# EAGLE design field_rotator (EAGLE 7.3.0)
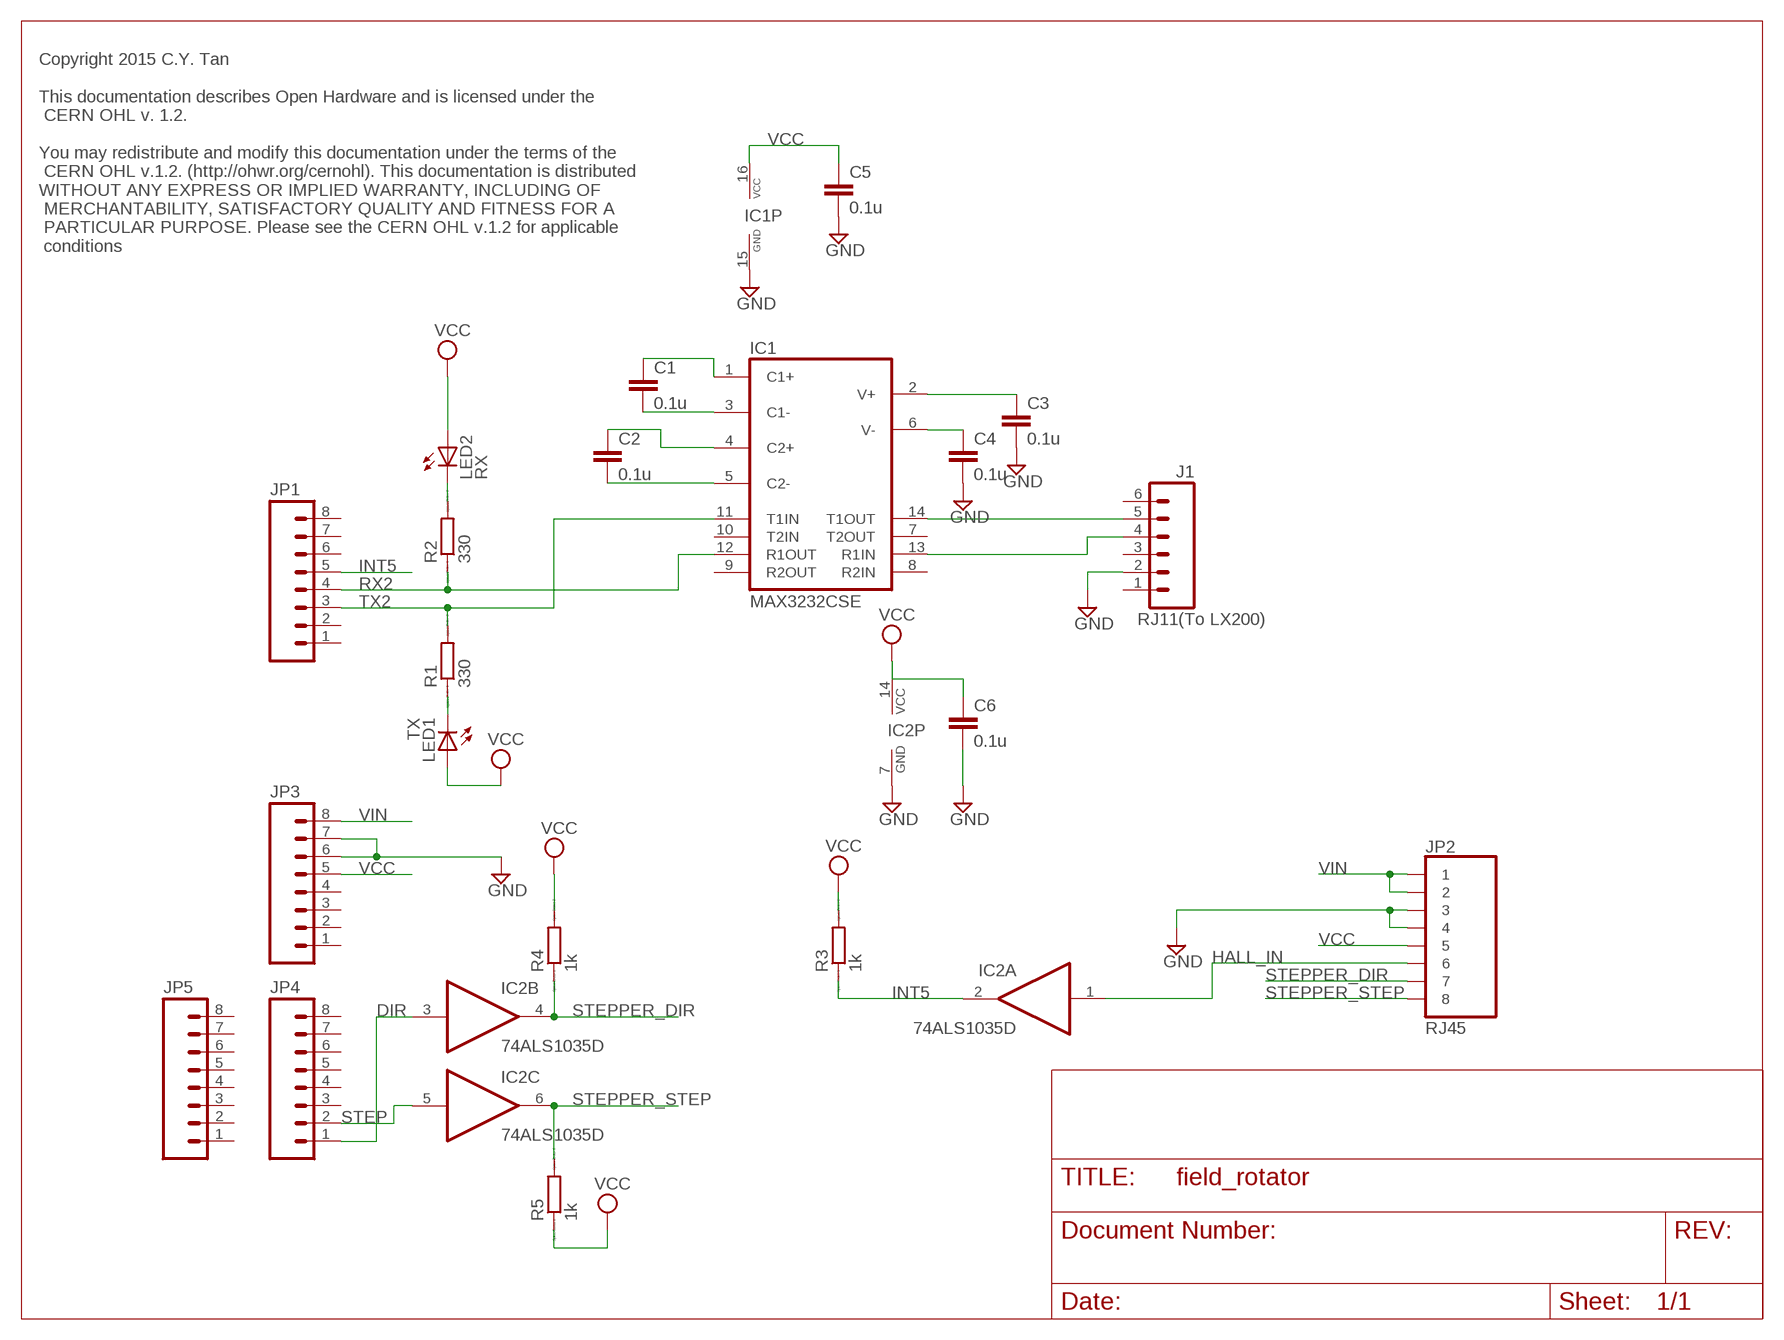
[diagram p0: schematic, sheet 1]

## Parts
C1  0.1u  C-EUC1206  [C1206]
C2  0.1u  C-EUC1206  [C1206]
C3  0.1u  C-EUC1206  [C1206]
C4  0.1u  C-EUC1206  [C1206]
C5  0.1u  C-EUC1206  [C1206]
C6  0.1u  C-EUC1206  [C1206]
IC1  MAX3232CSE  [SO16]
IC2  74ALS1035D  [SO14]
J1  RJ11(To LX200)  RJ11-6PTH  [RJ11-6]
JP1  M08SILK_FEMALE_PTH  [1X08]
JP2  RJ45  RJ45-8PTH  [RJ45-8]
JP3  M08SILK_FEMALE_PTH  [1X08]
JP4  M08SILK_FEMALE_PTH  [1X08]
JP5  M08SILK_FEMALE_PTH  [1X08]
LED1  TX  LEDCHIPLED_1206  [CHIPLED_1206]
LED2  RX  LEDCHIPLED_1206  [CHIPLED_1206]
R1  330  R  [R0805]
R2  330  R  [R0805]
R3  1k  R  [R0805]
R4  1k  R  [R0805]
R5  1k  R  [R0805]

## Nets
DIR: IC2.3(B:I) JP4.1
GND: C3.2 C4.2 C5.2 C6.2 IC1.15(GND) IC2.7(P:GND) J1.2 JP2.3 JP2.4 JP3.6 JP3.7
HALL_IN: IC2.1(A:I) JP2.6
INT5: IC2.2(A:O) JP1.5 R3.1
N$1: C1.1 IC1.1(C1+)
N$2: C1.2 IC1.3(C1-)
N$3: C2.1 IC1.4(C2+)
N$4: C2.2 IC1.5(C2-)
N$5: C3.1 IC1.2(V+)
N$6: C4.1 IC1.6(V-)
N$7: LED1.C R1.1
N$8: LED2.C R2.2
N$9: IC1.14(T1OUT) J1.5
N$10: IC1.13(R1IN) J1.4
RX2: IC1.12(R1OUT) JP1.4 R2.1
STEP: IC2.5(C:I) JP4.2
STEPPER_DIR: IC2.4(B:O) JP2.7 R4.1
STEPPER_STEP: IC2.6(C:O) JP2.8 R5.2
TX2: IC1.11(T1IN) JP1.3 R1.2
VCC: C5.1 C6.1 IC1.16(VCC) IC2.14(P:VCC) JP2.5 JP3.5 LED1.A LED2.A R3.2 R4.2 R5.1
VIN: JP2.1 JP2.2 JP3.8
Unconnected: IC1.7(T2OUT) IC1.8(R2IN) IC1.9(R2OUT) IC1.10(T2IN) IC2.8(D:O) IC2.9(D:I) IC2.10(E:O) IC2.11(E:I) IC2.12(F:O) IC2.13(F:I) J1.1 J1.3 J1.6 JP1.1 JP1.2 JP1.6 JP1.7 JP1.8 JP3.1 JP3.2 JP3.3 JP3.4 JP4.3 JP4.4 JP4.5 JP4.6 JP4.7 JP4.8 JP5.1 JP5.2 JP5.3 JP5.4 JP5.5 JP5.6 JP5.7 JP5.8

## Notes on the sheet
- Copyright 2015 C.Y. Tan
  
  This documentation describes Open Hardware and is licensed under the
   CERN OHL v. 1.2. 
  
  You may redistribute and modify this documentation under the terms of the
   CERN OHL v.1.2. (http://ohwr.org/cernohl). This documentation is distributed 
  WITHOUT ANY EXPRESS OR IMPLIED WARRANTY, INCLUDING OF
   MERCHANTABILITY, SATISFACTORY QUALITY AND FITNESS FOR A
   PARTICULAR PURPOSE. Please see the CERN OHL v.1.2 for applicable
   conditions

## Library data of the parts
C1-C6 = resistor:C-EU: CAPACITOR, European symbol
IC1 = maxim:MAX3232*: True RS-232 Transceivers 3.0V to 5.5V, Low-Power up to 1Mbps, Using Four 0.1µF External Capacitors Source: http://pdfserv.maxim-ic.com/en/ds/MAX3222-MAX3241.pdf; MPN: MAX3232CSE; OC_FARNELL: 9725490; OC_NEWARK: 90C2890
IC2 = cytan:74ALS1035: Hex noninverting buffers with open-collector outputs
J1 = cytan:RJ11-6: RJ11 Jack Simple 6 pin RJ11 jack. Commonly found on CAT3 devices and Microchip programmers. SKU: Jameco-115837; PROD_ID: Jameco-115837; VALUE: RJ11
JP1 JP3-JP5 = SparkFun-Connectors:M08: Header 8 Standard 8-pin 0.1" header. Use with straight break away headers (SKU : PRT-00116), right angle break away headers (PRT-00553), swiss pins (PRT-00743), machine pins (PRT-00117), and female headers (PRT-00115).; PROD_ID: CONN-08438
JP2 = cytan:RJ45-8: RJ45 Jack RJ45, 8-pin connection. SKU: Jameco 524461.; PROD_ID: Jameco-524461
LED1 LED2 = led:LED: LED OSRAM: - CHIPLED LG R971, LG N971, LY N971, LG Q971, LY Q971, LO R971, LY R971 LH N974, LH R974 LS Q976, LO Q976, LY Q976 LO Q996 - Hyper CHIPLED LW Q18S LB Q993, LB Q99A, LB R99A - SideLED LS A670, LO A670, LY A670, LG A670, LP A670 LB A673, LV A673, LT A673, LW A673 LH A674 LY A675 LS A676, LA A676, LO A676, LY A676, LW A676 LS A679, LY A679, LG A679 - Hyper Micro SIDELED® LS Y876, LA Y876, LO Y876, LY Y876 LT Y87S - SmartLED LW L88C, LW L88S LB L89C, LB L89S, LG L890 LS L89K, LO L89K, LY L89K LS L896, LA L896, LO L896, LY L896 - TOPLED LS T670, LO T670, LY T670, LG T670, LP T670 LSG T670, LSP T670, LSY T670, LOP T670, LYG T670 LG T671, LOG T671, LSG T671 LB T673, LV T673, LT T673, LW T673 LH T674 LS T676, LA T676, LO T676, LY T676, LB T676, LH T676, LSB T676, LW T676 LB T67C, LV T67C, LT T67C, LS T67K, LO T67K, LY T67K, LW E67C LS E67B, LA E67B, LO E67B, LY E67B, LB E67C, LV E67C, LT E67C LW T67C LS T679, LY T679, LG T679 LS T770, LO T770, LY T770, LG T770, LP T770 LB T773, LV T773, LT T773, LW T773 LH T774 LS E675, LA E675, LY E675, LS T675 LS T776, LA T776, LO T776, LY T776, LB T776 LHGB T686 LT T68C, LB T68C - Hyper Mini TOPLED® LB M676 - Mini TOPLED Santana® LG M470 LS M47K, LO M47K, LY M47K Source: http://www.osram.convergy.de LUXEON: - LUMILED® LXK2-PW12-R00, LXK2-PW12-S00, LXK2-PW14-U00, LXK2-PW14-V00 LXK2-PM12-R00, LXK2-PM12-S00, LXK2-PM14-U00 LXK2-PE12-Q00, LXK2-PE12-R00, LXK2-PE12-S00, LXK2-PE14-T00, LXK2-PE14-U00 LXK2-PB12-K00, LXK2-PB12-L00, LXK2-PB12-M00, LXK2-PB14-N00, LXK2-PB14-P00, LXK2-PB14-Q00 LXK2-PR12-L00, LXK2-PR12-M00, LXK2-PR14-Q00, LXK2-PR14-R00 LXK2-PD12-Q00, LXK2-PD12-R00, LXK2-PD12-S00 LXK2-PH12-R00, LXK2-PH12-S00 LXK2-PL12-P00, LXK2-PL12-Q00, LXK2-PL12-R00 Source: www.luxeon.com KINGBRIGHT: KA-3528ASYC Source: www.kingbright.com
R1-R5 = eagle-ltspice:R: RESISTOR, European symbol; SPICEMODEL: NONE; SPICEPREFIX: R

## Board
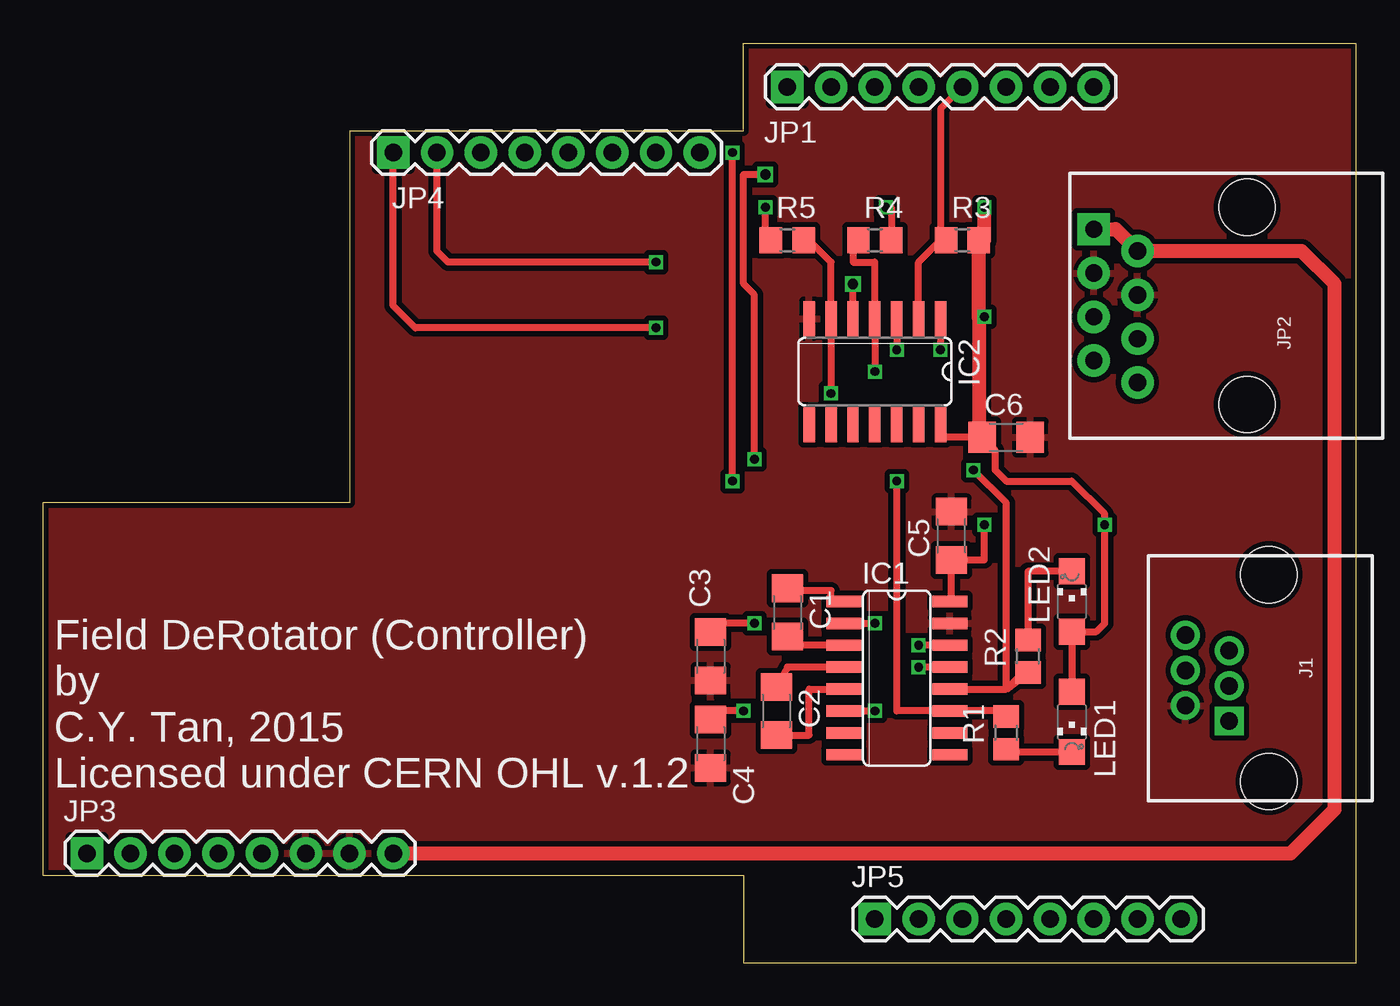
[diagram p1: board, top side]
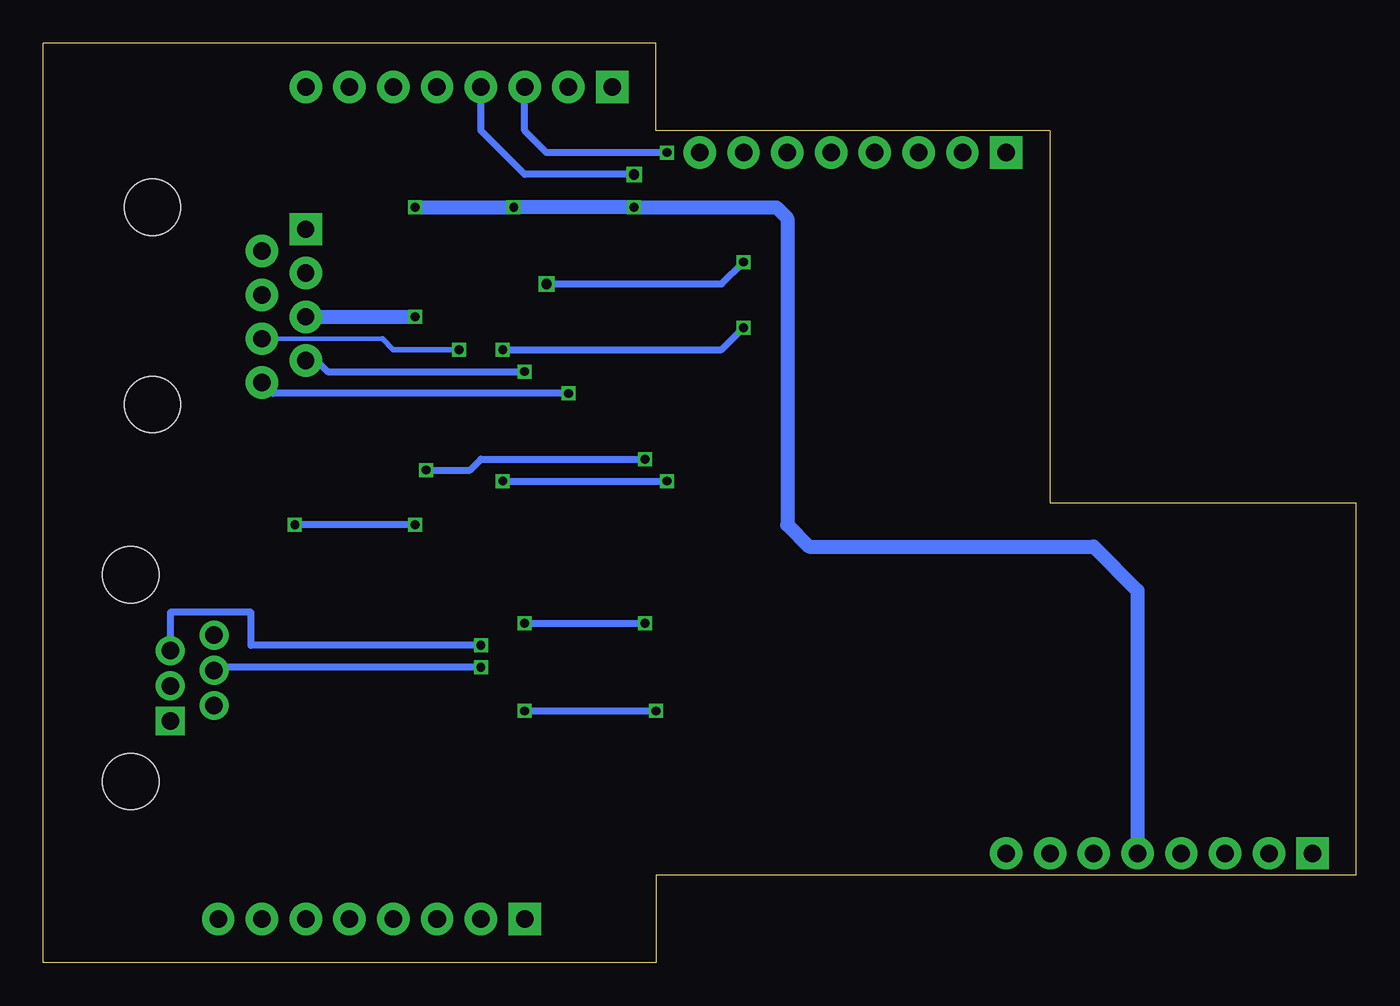
[diagram p2: board, bottom side, seen from below]

Size 76.2 x 53.34 mm. Coordinates in mm from the lower left corner, seen from the top.
Outline: 0,5.08 0,26.67 17.78,26.67 17.78,48.26 40.64,48.26 40.64,53.34 76.2,53.34 76.2,0 40.64,0 40.64,5.08 0,5.08
Copper layers (1*16): Top 0.035mm / dielectric 1.5mm / Bottom 0.035mm
Design rules "ITEADstudio_DRC": minimum track width 6mil, minimum drill 12mil, track to track 6mil, track to pad 6mil, pad to pad 6mil, via to via 6mil, smd to smd 0mil, copper to edge 10mil, drill to drill 10mil, minimum pad ring 10mil, minimum via ring 6mil, stop-mask expansion 2mil, vias tented up to drill 100mil, thermal gap 10mil

### Footprints (pad centres in the part's own frame; a part is rotated, then mirrored left to right if it is on the bottom)
C1206 = smd 1.6 x 1.8: 1 -1.4,0; 2 1.4,0
SO16 = smd 0.66 x 2.032: 1 -4.445,-3.073; 2 -3.175,-3.073; 3 -1.905,-3.073; 4 -0.635,-3.073; 5 0.635,-3.073; 6 1.905,-3.073; 7 3.175,-3.073; 8 4.445,-3.073; 9 4.445,3.073; 10 3.175,3.073; 11 1.905,3.073; 12 0.635,3.073; 13 -0.635,3.073; 14 -1.905,3.073; 15 -3.175,3.073; 16 -4.445,3.073
SO14 = smd 0.66 x 2.032: 1 -3.81,-3.073; 2 -2.54,-3.073; 3 -1.27,-3.073; 4 0,-3.073; 5 1.27,-3.073; 6 2.54,-3.073; 7 3.81,-3.073; 8 3.81,3.073; 9 2.54,3.073; 10 1.27,3.073; 11 0,3.073; 12 -1.27,3.073; 13 -2.54,3.073; 14 -3.81,3.073
RJ11-6 = drill 1.016 pad 1.676 square: 1 -2.489,2.299 | drill 1.016 pad 1.676: 2 -1.59,4.839; 3 -0.45,2.299; 4 0.45,4.839; 5 1.59,2.299; 6 2.489,4.839 | hole 3.251: -5.999,0; 5.999,0
1X08 = drill 1.016 pad 1.88 square: 1 0,0 | drill 1.016 pad 1.88: 2 2.54,0; 3 5.08,0; 4 7.62,0; 5 10.16,0; 6 12.7,0; 7 15.24,0; 8 17.78,0
RJ45-8 = drill 1 pad 1.88 square: 1 4.445,8.89 | drill 1 pad 1.88: 2 3.175,6.35; 3 1.905,8.89; 4 0.635,6.35; 5 -0.635,8.89; 6 -1.905,6.35; 7 -3.175,8.89; 8 -4.445,6.35 | hole 3.251: -5.715,0; 5.715,0
CHIPLED_1206 = smd 1.5 x 1.5: A 0,-1.75; C 0,1.75
R0805 = smd 1.3 x 1.5: 1 -0.95,0; 2 0.95,0

### Placement (x,y rotation side)
C1  43.18,20.32 270 top
C2  42.55,14.61 270 top
C3  38.73,17.78 270 top
C4  38.73,12.7 270 top
C5  52.7,24.77 90 top
C6  55.88,30.48 0 top
IC1  49.53,16.51 270 top
IC2  48.26,34.29 180 top
J1  71.12,16.51 90 top
JP1  43.18,50.8 0 top
JP2  69.85,38.1 90 top
JP3  2.54,6.35 0 top
JP4  20.32,46.99 0 top
JP5  48.26,2.54 0 top
LED1  59.69,13.97 180 top
LED2  59.69,20.95 0 top
R1  55.88,13.34 90 top
R2  57.15,17.78 90 top
R3  53.34,41.91 0 top
R4  48.26,41.91 0 top
R5  43.18,41.91 0 top

### Tracks (layer width: path | path; a pad name or v marks a point on that pad's centre or on a via)
DIR  (via drill 0.51)
  Top 0.406: IC2.3 v49.53,35.56 | v35.56,36.83 21.59,36.83 20.32,38.1 JP4.1
  Bottom 0.406: v49.53,35.56 36.83,35.56 v35.56,36.83
GND
  pour Top (isolate 0.305): 0,26.67 0,5.08 40.64,5.08 40.64,3.81 40.64,0 76.2,0 76.2,53.34 40.64,53.34 40.64,48.26 17.78,48.26 17.78,26.67
HALL_IN  (via drill 0.51)
  Top 0.406: IC2.1 v52.07,35.56
  Bottom 0.254: 56.52,36.2 JP2.6
  Bottom 0.305: v52.07,35.56 55.88,35.56 56.52,36.2
INT5
  Top 0.406: IC2.2 50.8,40.64 52.07,41.91 R3.1 52.07,42.23 52.07,49.53 JP1.5
N$1
  Top 0.406: IC1.1 45.72,20.95 45.72,21.59 43.18,21.59 C1.1
N$2
  Top 0.406: IC1.3 43.18,18.41 C1.2
N$3
  Top 0.406: IC1.4 43.18,17.14 C2.1
N$4
  Top 0.406: C2.2 44.45,13.21 44.45,15.88 IC1.5
N$5  (via drill 0.51)
  Top 0.406: IC1.2 v48.26,19.69 | v41.27,19.69 38.73,19.69 C3.1
  Bottom 0.406: v48.26,19.69 v41.27,19.69
N$6  (via drill 0.51)
  Top 0.406: IC1.6 v48.26,14.61 | v40.64,14.61 38.73,14.61 C4.1
  Bottom 0.406: v48.26,14.61 v40.64,14.61
N$7
  Top 0.406: LED1.C 55.88,12.22 R1.1
N$8
  Top 0.406: LED2.C 57.15,22.7 R2.2
N$9  (via drill 0.51)
  Top 0.406: IC1.14 v50.8,18.41
  Bottom 0.406: v50.8,18.41 64.14,18.41 64.14,20.32 68.82,20.32 J1.5
N$10  (via drill 0.51)
  Top 0.406: IC1.13 v50.8,17.14
  Bottom 0.406: v50.8,17.14 66.28,17.14 J1.4
RX2  (via drill 0.51, 0.6)
  Top 0.406: IC1.12 55.88,15.88 | 55.88,15.88 R2.1 56.84,16.83 55.88,15.88 | 55.88,15.88 55.88,26.67 v53.98,28.58 | v41.27,29.21 41.27,38.73 40.64,39.37 40.64,45.72 v41.91,45.72
  Bottom 0.406: v53.98,28.58 51.44,28.58 50.8,29.21 v41.27,29.21 | v41.91,45.72 48.26,45.72 50.8,48.26 JP1.4
STEP  (via drill 0.51, 0.6)
  Top 0.406: IC2.5 v46.99,39.37 | v35.56,40.64 23.5,40.64 22.86,41.27 JP4.2
  Bottom 0.406: v46.99,39.37 36.83,39.37 v35.56,40.64
STEPPER_DIR  (via drill 0.51)
  Top 0.406: v48.26,34.29 IC2.4 48.26,40.64 46.99,40.64 46.99,41.59 R4.1
  Bottom 0.406: JP2.7 60.33,34.92 59.69,34.29 v48.26,34.29
STEPPER_STEP  (via drill 0.51)
  Top 0.406: R5.2 44.45,41.91 45.72,40.64 IC2.6 v45.72,33.02
  Bottom 0.406: v45.72,33.02 62.87,33.02 JP2.8
TX2  (via drill 0.51)
  Top 0.406: R1.2 55.88,14.61 IC1.11 49.53,14.61 v49.53,27.94 | v40.01,27.94 v40.01,46.99
  Bottom 0.406: v49.53,27.94 v40.01,27.94 | v40.01,46.99 46.99,46.99 48.26,48.26 JP1.3
VCC  (via drill 0.51)
  Top 0.406: C6.1 52.07,30.48 IC2.14 | 49.53,41.91 R4.2 49.21,43.81 v48.9,43.81 | R5.1 41.91,41.91 v41.91,43.81 | R3.2 54.61,41.91 | v54.61,37.46 54.29,37.46 | LED1.A LED2.A 61.12,19.2 61.59,19.69 v61.59,25.4 61.59,26.03 59.69,27.94 55.88,27.94 55.24,28.58 55.24,29.72 C6.1 | 54.29,30.67 C6.1 | IC1.16 52.7,20.95 C5.1 54.61,23.37 v54.61,25.4
  Top 0.813: 54.61,41.91 v54.61,43.81 | R3.2 54.29,37.46 54.29,30.67
  Bottom 0.406: v54.61,25.4 v61.59,25.4
  Bottom 0.813: v54.61,43.81 v48.9,43.81 v41.91,43.81 33.66,43.81 33.02,43.18 33.02,25.4 31.75,24.13 15.24,24.13 12.7,21.59 JP3.5 | JP2.5 v54.61,37.46
VIN
  Top 0.813: JP3.8 72.39,6.35 74.93,8.89 74.93,39.37 73.03,41.27 JP2.2 62.23,42.55 JP2.1

### Text on the board
tPlace: Field DeRotator (Controller) / by / C.Y. Tan, 2015 / Licensed under CERN OHL v.1.2